# Altium schematic sheet P03_Power.SchDoc
size 301 x 239 mm
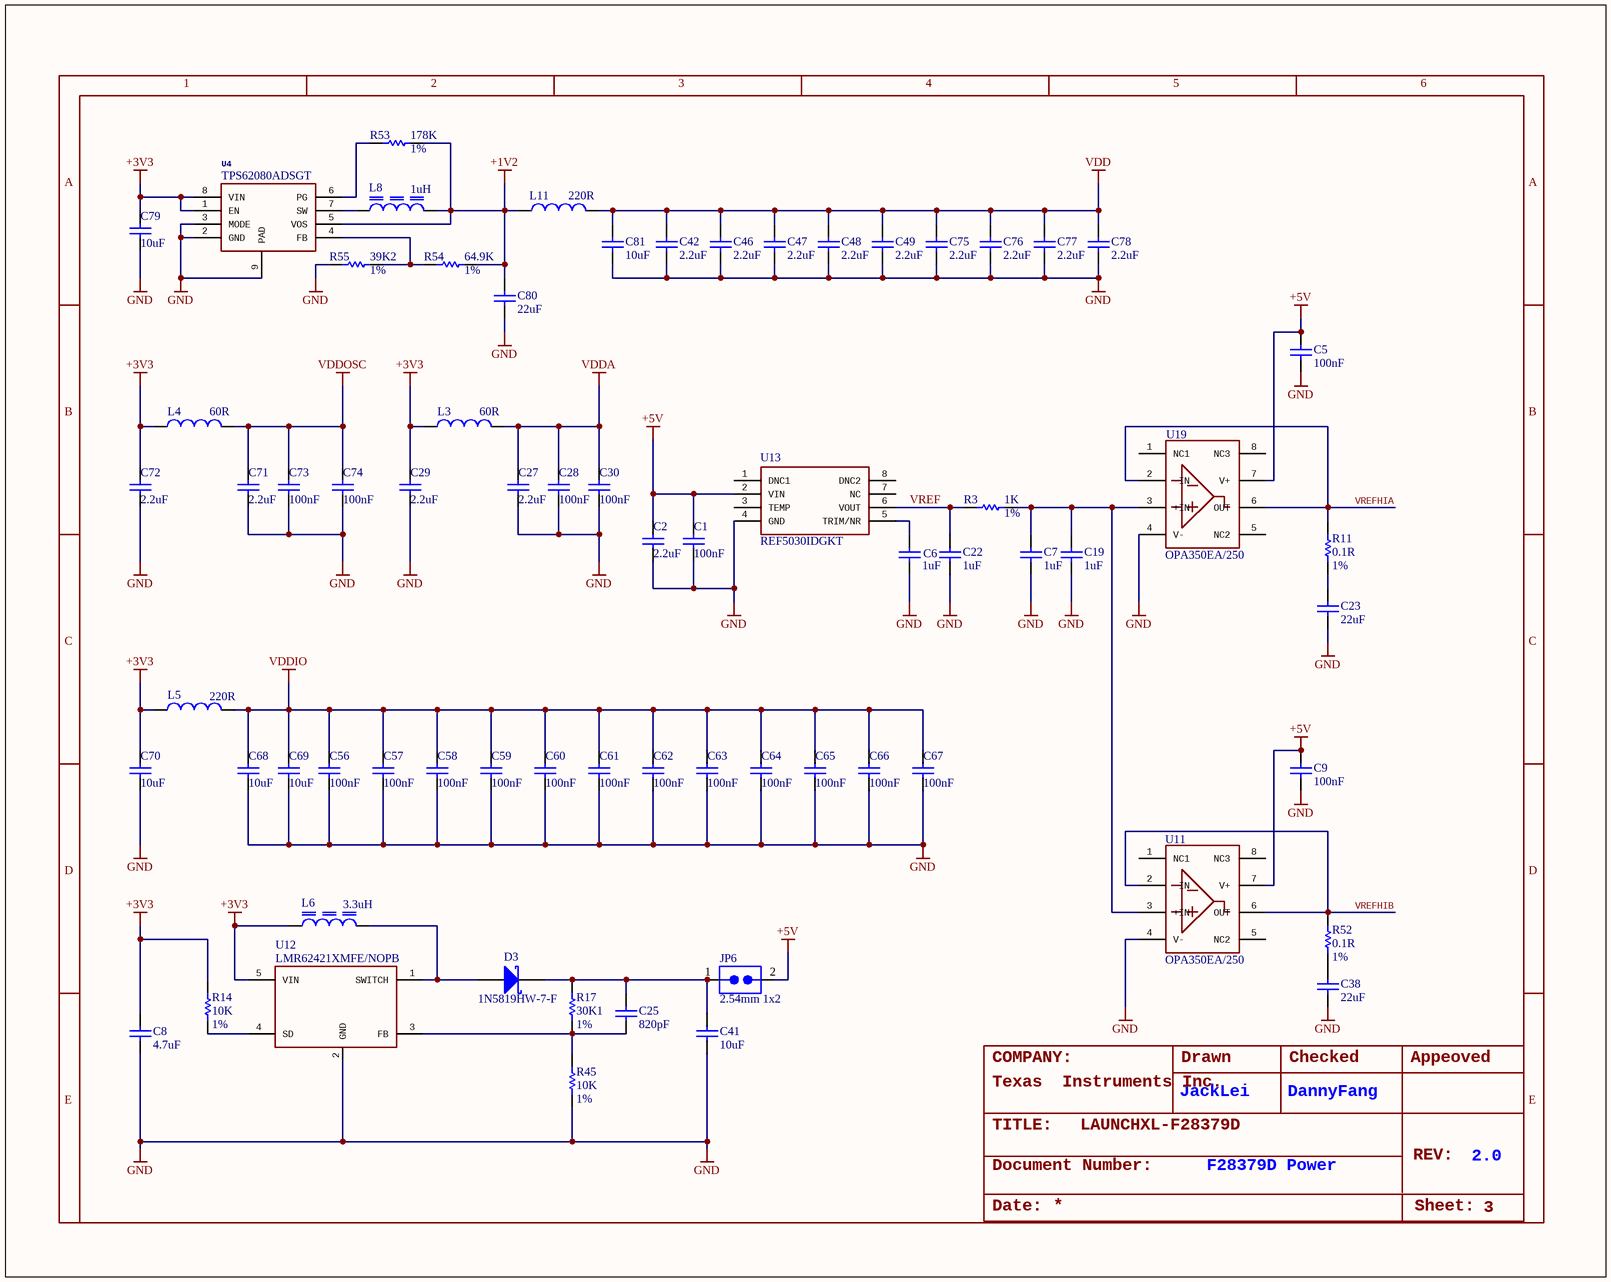
[diagram p0: P03_Power.SchDoc]

## Parts
C1  100nF  [C0402]
C2  2.2uF  [C0402]
C5  100nF  [C0402]
C6  1uF  [C0402]
C7  1uF  [C0402]
C8  4.7uF  [C0402]
C9  100nF  [C0402]
C19  1uF  [C0402]
C22  1uF  [C0402]
C23  22uF  [C0603]
C25  820pF  [C0402]
C27  2.2uF  [C0402]
C28  100nF  [C0402]
C29  2.2uF  [C0402]
C30  100nF  [C0402]
C38  22uF  [C0603]
C41  10uF  [C1210]
C42  2.2uF  [C0402]
C46  2.2uF  [C0402]
C47  2.2uF  [C0402]
C48  2.2uF  [C0402]
C49  2.2uF  [C0402]
C56  100nF  [C0402]
C57  100nF  [C0402]
C58  100nF  [C0402]
C59  100nF  [C0402]
C60  100nF  [C0402]
C61  100nF  [C0402]
C62  100nF  [C0402]
C63  100nF  [C0402]
C64  100nF  [C0402]
C65  100nF  [C0402]
C66  100nF  [C0402]
C67  100nF  [C0402]
C68  10uF  [C0603]
C69  10uF  [C0603]
C70  10uF  [C0603]
C71  2.2uF  [C0402]
C72  2.2uF  [C0402]
C73  100nF  [C0402]
C74  100nF  [C0402]
C75  2.2uF  [C0402]
C76  2.2uF  [C0402]
C77  2.2uF  [C0402]
C78  2.2uF  [C0402]
C79  10uF  [C0603]
C80  22uF  [C0603]
C81  10uF  [C0603]
D3  1N5819HW-7-F  [SOD-123]
JP6  value 2.54mm 1x2  [HDRV2W64P254_1X2_508X250X850P]  (hidden comment: P6E02A-602530-B1)
L3  60R  [L0402]
L4  60R  [L0402]
L5  220R  [L0402]
L6  3.3uH  [INDC380X380X165N]
L8  1uH  [INDC3030X12N]
L11  220R  [L0402]
R3  Rating: 1%  [R0402]  (hidden comment: 1K)
R11  Rating: 1%  [R0603]  (hidden comment: 0.1R)
R14  Rating: 1%  [R0402]  (hidden comment: 10K)
R17  Rating: 1%  [R0402]  (hidden comment: 30K1)
R45  Rating: 1%  [R0402]  (hidden comment: 10K)
R52  Rating: 1%  [R0603]  (hidden comment: 0.1R)
R53  Rating: 1%  [R0402]  (hidden comment: 178K)
R54  Rating: 1%  [R0402]  (hidden comment: 64.9K)
R55  Rating: 1%  [R0402]  (hidden comment: 39K2)
U4  TPS62080ADSGT  [WSON50P200X80_HS-9N]
U11  OPA350EA/250  [VSSOP65P490X110-8N]
U12  LMR62421XMFE/NOPB  [SOT23-5]
U13  REF5030IDGKT  [VSSOP65P490X110-8N]
U19  OPA350EA/250  [VSSOP65P490X110-8N]

## Nets
+1V2: C80.2 L8.2 L11.1 R53.2 R54.2 U4.5(VOS)
+3V3: C8.2 C29.2 C70.2 C72.2 C79.2 L3.1 L4.1 L5.1 L6.1 R14.1 U4.1(EN) U4.8(VIN) U12.5(VIN)
+5V: C1.2 C2.2 C5.2 C9.2 JP6.2 U11.7(V+) U13.2(VIN) U19.7(V+)
GND: C1.1 C2.1 C5.1 C6.1 C7.1 C8.1 C9.1 C19.1 C22.1 C23.1 C27.1 C28.1 C29.1 C30.1 C38.1 C41.2 C42.1 C46.1 C47.1 C48.1 C49.1 C56.1 C57.2 C58.1 C59.1 C60.1 C61.1 C62.1 C63.1 C64.1 C65.1 C66.1 C67.1 C68.1 C69.1 C70.1 C71.1 C72.1 C73.1 C74.1 C75.1 C76.1 C77.1 C78.1 C79.1 C80.1 C81.1 R45.2 R55.1 U4.2(GND) U4.3(MODE) U4.9(PAD) U11.4(V-) U12.2(GND) U13.4(GND) U19.4(V-)
VDD: C42.2 C46.2 C47.2 C48.2 C49.2 C75.2 C76.2 C77.2 C78.2 C81.2 L11.2
VDDA: C27.2 C28.2 C30.2 L3.2
VDDIO: C56.2 C57.1 C58.2 C59.2 C60.2 C61.2 C62.2 C63.2 C64.2 C65.2 C66.2 C67.2 C68.2 C69.2 L5.2
VDDOSC: C71.2 C73.2 C74.2 L4.2
VREF: C22.2 R3.1 U13.6(VOUT)
VREFHIA: R11.2 U19.2(-IN) U19.6(OUT)
VREFHIB: R52.2 U11.2(-IN) U11.6(OUT)
NetC6_2: C6.2 U13.5(TRIM/NR)
NetC7_2: C7.2 C19.2 R3.2 U11.3(+IN) U19.3(+IN)
NetC23_2: C23.2 R11.1
NetC25_1: C25.1 R17.2 R45.1 U12.3(FB)
NetC25_2: C25.2 C41.1 D3.1 JP6.1 R17.1
NetC38_2: C38.2 R52.1
NetD3_2: D3.2 L6.2 U12.1(SWITCH)
NetL8_1: L8.1 U4.7(SW)
NetR14_2: R14.2 U12.4(SD)
NetR53_1: R53.1 U4.6(PG)
NetR54_1: R54.1 R55.2 U4.4(FB)

Not connected (* = marked no-connect by the designer): U11 1(NC1) 5(NC2) 8(NC3); U13 1(DNC1) 3(TEMP) 7(NC) 8(DNC2); U19 1(NC1) 5(NC2) 8(NC3)

## Notes on the sheet
- COMPANY:
- Texas
  Instruments Inc.
- JackLei
- Drawn
- DannyFang
- Checked
- Appeoved
- TITLE:
- Document Number:
- LAUNCHXL-F28379D
- F28379D Power
- REV:
- 2.0
- Date:
- Sheet:
- 3
- 1
- 2
- 4
- 5
- 6
- A
- B
- C
- D
- E

## Library data of the parts
C1 C5 C9 C28 C30 C56-C67 C73 C74 = 1004001100187: CAP,100NF(0.1uf),+/-10%,X5R,10V,SMD0402; Manufacturer: MURATA; Manufacturer Part Number: GRM155R61A104KA01D; Rating: 10%; Embest PN: 1004001100187; Value: 100nF; Part Type: Ceramic Capacitor
C2 C27 C29 C42 C46-C49 C71 C72 C75-C78 = 1004001100059: CAP,2.2UF,+/-20%,X5R,6.3V,SMD0402; Manufacturer: MURATA; Manufacturer Part Number: GRM155R60J225ME15D; Rating: 20%; Embest PN: 1004001100059; Value: 2.2uF; Part Type: Ceramic Capacitor
C6 C7 C19 C22 = 1004001100056: CAP,1UF,+/-10%,X5R,6.3V,SMD0402; Manufacturer: MURATA; Manufacturer Part Number: GRM155R60J105KE19D; Rating: 10%; Embest PN: 1004001100056; Value: 1uF; Part Type: Ceramic Capacitor
C8 = 1004001100218: CAP,4.7UF,+/-20%,X5R,6.3V,SMD0402 fix PN add D（20151023）; Manufacturer: MURATA; Manufacturer Part Number: GRM155R60J475ME47D; Rating: 20%; Embest PN: 1004001100218; Value: 4.7uF; Part Type: Ceramic Capacitor
C23 C38 C80 = 1004001100130: CAP,22UF,+/-20%,X5R,6.3V,SMD0603; Manufacturer: MURATA; Manufacturer Part Number: GRM188R60J226MEA0D; Rating: 20%; Embest PN: 1004001100130; Value: 22uF; Part Type: Ceramic Capacitor
C25 = 1004001100029: CAP,820PF,+/-5%,C0G,50V,SMD0402; Manufacturer: MURATA; Manufacturer Part Number: GRM1555C1H821JA01D; Rating: 5%; Embest PN: 1004001100029; Value: 820pF; Part Type: Ceramic Capacitor
C41 = 1004001100183: CAP,10UF,+/-10%,X7R,25V,SMD1210; Manufacturer: MURATA; Manufacturer Part Number: GRM32DR71E106KA12L; Rating: 10%; Embest PN: 1004001100183; Value: 10uF; Part Type: Ceramic Capacitor
C68-C70 C79 C81 = 1004001100128: CAP,10UF,+/-20%,X5R,6.3V,SMD0603; Manufacturer: MURATA; Manufacturer Part Number: GRM188R60J106ME47D; Rating: 20%; Embest PN: 1004001100128; Value: 10uF; Part Type: Ceramic Capacitor
D3 = 1006002100003: Diode,Schottky Diode,1N5819HW-7-F,40V,1A,SOD-123,SMD,-65~125,TR; Manufacturer: DIODES; Embest PN: 1006002100003; Value: 1N5819HW-7-F; Part Type: Diode; Rating: 1A; Manufacturer Part Number: 1N5819HW-7-F
JP6 = 1009001200003: Connector,Pin Header,Straight,Male,1x2Pin,2.54MM pitch,6.00,3.00,Gold Flash 1u, black,DIP,alt_code:15071705; Manufacturer: CHIN-BAN; Embest PN: 1009001200003; Part Type: Pin Header; Manufacturer Part Number: P6E02A-602530-B1
L3 L4 = 1005005100005: Ferrite Bead,60ohm@100MHz,+/-25%,1700mA,0.06ohm,SMD0402; Manufacturer: MURATA; Manufacturer Part Number: BLM15PD600SN1D; Embest PN: 1005005100005; Value: 60R; Part Type: Ferrite Bead; Rating: 1700mA
L5 L11 = 1005005100064: FERRITE BEAD 220 OHM 0402,+/-25%; Manufacturer: Taiyo Yuden; Manufacturer Part Number: BKP1005EM221-T; Embest PN: 1005005100064; Value: 220R; Part Type: Ferrite Bead
L6 = 1005004100014: Power Inductor,Magnetic shielded,3.3uH,1.4A,0.085ohm,3.8X3.8X1.6mm,SMD; Manufacturer: SUMIDA; Manufacturer Part Number: CDRH3D16/HPNP-3R3NC; Embest PN: 1005004100014; Value: 3.3uH; Part Type: Inductor; Rating: 1.4A
L8 = 1005001100053: FIXED IND 1UH 1.62A 40 MOHM SMD,+/-30%; Manufacturer: MURATA; Manufacturer Part Number: LQH3NPN1R0NJ0L; Embest PN: 1005001100053; Value: 1uH; Part Type: Inductor; Rating: 1.62A
R3 = 1003001100034: RES,1K,+/-1%,1/16W,SMD0402; Manufacturer: YAGEO; Manufacturer Part Number: RC0402FR-071KL; Embest PN: 1003001100034; Value: 1K; Part Type: Thick film Resistor
R11 R52 = 1003001100162: RES,0R1,+/-1%,1/10W,SMD0603; Manufacturer: YAGEO; Manufacturer Part Number: RL0603FR-070R1L; Embest PN: 1003001100162; Value: 0.1R; Part Type: Thick film Resistor
R14 R45 = 1003001100071: RES,10K,+/-1%,1/16W,SMD0402; Manufacturer: YAGEO; Manufacturer Part Number: RC0402FR-0710KL; Embest PN: 1003001100071; Value: 10K; Part Type: Thick film Resistor
R17 = 1003001100091: RES,30K1,+/-1%,1/16W,SMD0402; Manufacturer: YAGEO; Manufacturer Part Number: RC0402FR-0730K1L; Embest PN: 1003001100091; Value: 30K1; Part Type: Thick film Resistor
R53 = 1003001100723: RES, 178K OHM, 1%, 1/10W, SMD0402; Manufacturer: PANASONIC; Manufacturer Part Number: ERJ-2RKF1783X; Embest PN: 1003001100723; Value: 178K; Part Type: Thick film Resistor
R54 = 1003001100730: RES, 64.9K OHM, 1%, 1/10W, SMD0402; Manufacturer: PANASONIC; Manufacturer Part Number: ERJ-2RKF6492X; Embest PN: 1003001100730; Value: 64.9K; Part Type: Thick film Resistor
R55 = 1003001100098: RES,39K2,+/-1%,1/16W,SMD0402; Manufacturer: YAGEO; Manufacturer Part Number: RC0402FR-0739K2L; Embest PN: 1003001100098; Value: 39K2; Part Type: Thick film Resistor
U4 = 1002005100089C: IC REG BUCK SYNC ADJ 1.2A 8WSON; Manufacturer: TI; Embest PN: 1002005100089C; Value: TPS62080ADSGT; Part Type: DC-DC; Manufacturer Part Number: TPS62080ADSGT
U11 U19 = 1002007100063C: IC OPAMP GP 38MHZ RRO 8VSSOP T/R; Manufacturer: TI; Embest PN: 1002007100063C; Value: OPA350EA/250; Part Type: Amplifier; Manufacturer Part Number: OPA350EA/250
U12 = 1002005100073C: Conv DC-DC Single Step Up 2.7V to 5.5V 5-Pin SOT-23 T/R ,CUSTOMER SUPPLY; Manufacturer: TI; Embest PN: 1002005100073C; Value: LMR62421XMFE/NOPB; Part Type: DC-DC; Manufacturer Part Number: LMR62421XMFE/NOPB
U13 = 1002004100186C: IC ，V-Ref Precision 3V 10mA 8-Pin VSSOP T/R; Manufacturer: TI; Embest PN: 1002004100186C; Value: REF5030IDGKT; Part Type: Power Management; Manufacturer Part Number: REF5030IDGKT